# Altium project ((Inventory)).PrjPcb
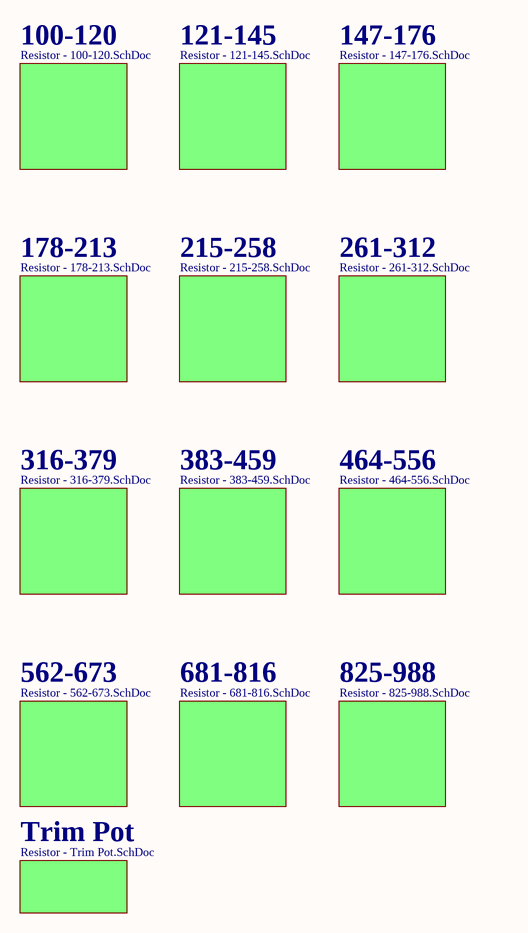
[diagram p0: Resistor.SchDoc]
7 sheets, 6 parts. Net scope: strictly hierarchical (ports join the sheet entries above them; power ports are local).
Sheets:
  Resistor.SchDoc
  Diode.SchDoc
  Ferrite.SchDoc
  Inductor.SchDoc
  Module.SchDoc
    LCD = Module - LCD.SchDoc
  Switch.SchDoc

## Sheet Resistor.SchDoc
size A; SheetNumber: 1; SheetTotal: 14

### Sub-sheets
100-120 = Resistor - 100-120.SchDoc (file not in this document): no entries
121-145 = Resistor - 121-145.SchDoc (file not in this document): no entries
147-176 = Resistor - 147-176.SchDoc (file not in this document): no entries
178-213 = Resistor - 178-213.SchDoc (file not in this document): no entries
215-258 = Resistor - 215-258.SchDoc (file not in this document): no entries
261-312 = Resistor - 261-312.SchDoc (file not in this document): no entries
316-379 = Resistor - 316-379.SchDoc (file not in this document): no entries
383-459 = Resistor - 383-459.SchDoc (file not in this document): no entries
464-556 = Resistor - 464-556.SchDoc (file not in this document): no entries
562-673 = Resistor - 562-673.SchDoc (file not in this document): no entries
681-816 = Resistor - 681-816.SchDoc (file not in this document): no entries
825-988 = Resistor - 825-988.SchDoc (file not in this document): no entries
Trim Pot = Resistor - Trim Pot.SchDoc (file not in this document): no entries

## Sheet Diode.SchDoc
size A3; SheetNumber: 22; SheetTotal: 41
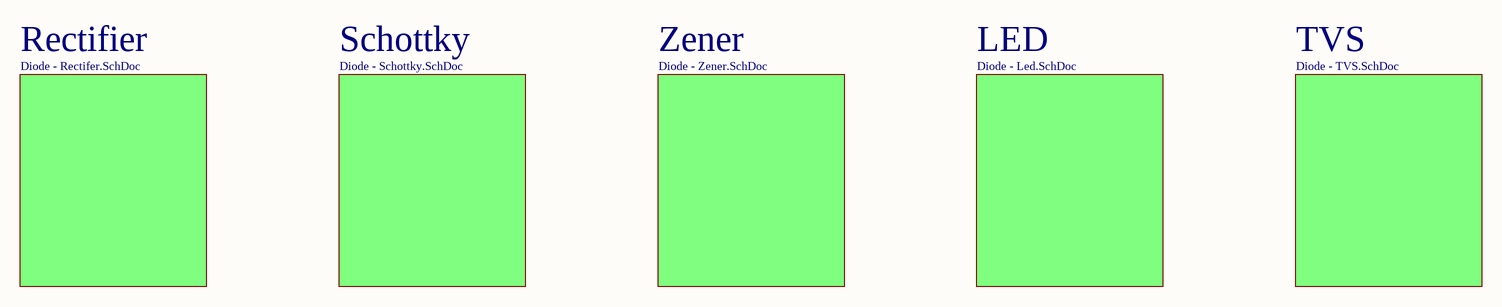
[diagram p1: Diode.SchDoc]

### Sub-sheets
LED = Diode - Led.SchDoc (file not in this document): no entries
Rectifier = Diode - Rectifer.SchDoc (file not in this document): no entries
Schottky = Diode - Schottky.SchDoc (file not in this document): no entries
TVS = Diode - TVS.SchDoc (file not in this document): no entries
Zener = Diode - Zener.SchDoc (file not in this document): no entries

## Sheet Ferrite.SchDoc
size A3; SheetNumber: 22; SheetTotal: 25
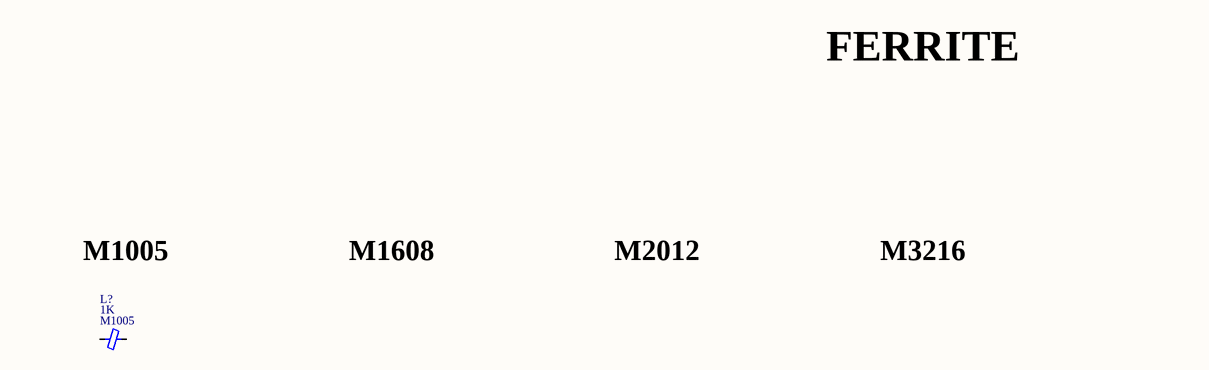
[diagram p2: Ferrite.SchDoc]

### Parts
(Parts that share a designator on the sheet are numbered #1, #2 ... from top to bottom, then left to right.)
L?#1  value 1K  Package: M1005  [Ferrite_Bead_Smd_M1005_I0402]  (hidden comment: Ferrite Bead)

### Nets

Not connected (* = marked no-connect by the designer): L?#1 1 2

### Notes on the sheet
- FERRITE
- (near L?#1) M1005
- M1608
- M2012
- M3216

### Library data of the parts
L?#1 = Ferrite Bead: Manufacturer Part Number: WLBD1005K2U102TP; Manufacturer: Walsin; Component Category: Inductor; ComponentLink1Description: Datasheet; ComponentLink1URL: E:\Altium\Datasheets\Inductor\Walsin, WLBD1005-WLBD4532 Chip Bead Series.pdf; ComponentLink2Description: Supplier Link; ComponentLink2URL: https://www.digikey.com/en/products/detail/walsin-technology-corporation/WLBD1005K2U102TP/14563847; Supplier: Digikey; Supplier Part Number: 1292-WLBD1005K2U102TPCT-ND; Operating Temperature, Min: -55℃; Operating Temperature, Max: +125℃; Quantity, Min: 1; Quantity, Max: 50000; Price, Min: 0.1; Price, Max: 0.0021; Supplier Currency: $; Supplier Link: https://www.digikey.com/en/products/detail/walsin-technology-corporation/WLBD1005K2U102TP/14563847; Component Type: Ferrite Bead

## Sheet Inductor.SchDoc
size A3; SheetNumber: 34; SheetTotal: 41
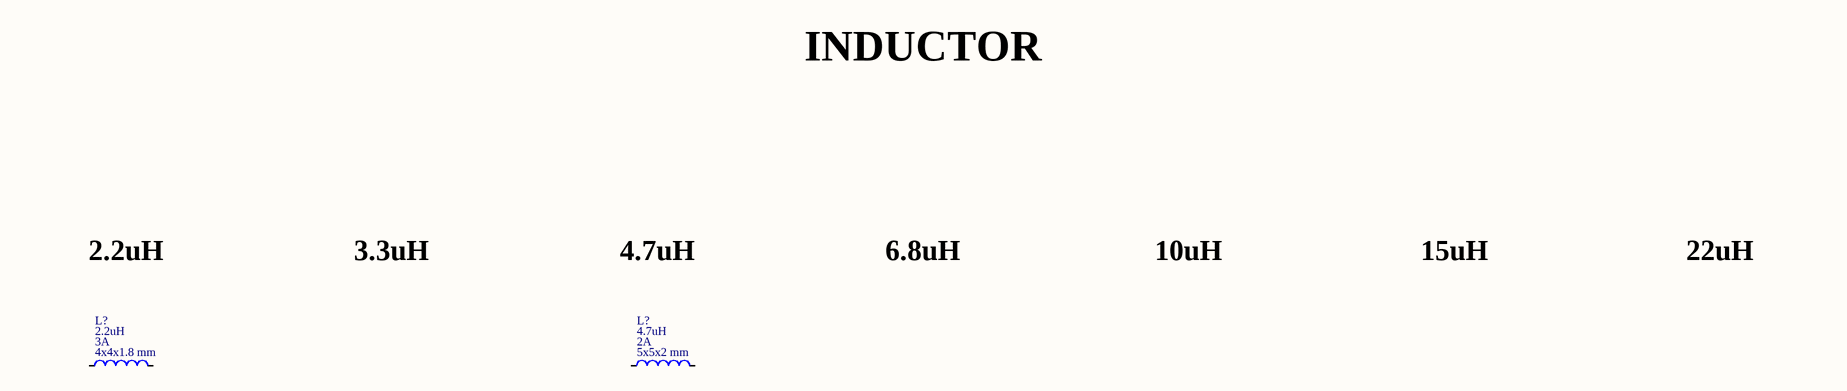
[diagram p3: Inductor.SchDoc]

### Parts
(Parts that share a designator on the sheet are numbered #1, #2 ... from top to bottom, then left to right.)
L?#2  value 2.2uH  Saturation Current: 3A  Package: 4x4x1.8 mm  [Taiyo Yuden - Power Inductor, 4040TK]  (hidden comment: Inductor)
L?#3  value 4.7uH  Saturation Current: 2A  Package: 5x5x2 mm  [Taiyo Yuden - Power Inductor, 5050WK]  (hidden comment: Inductor)

### Nets

Not connected (* = marked no-connect by the designer): L?#2 1 2; L?#3 1 2

### Notes on the sheet
- INDUCTOR
- 2.2uH
- 3.3uH
- 4.7uH
- 6.8uH
- 10uH
- 15uH
- 22uH

### Library data of the parts
L?#2 = Inductor: Inductor, Power, 2.2uH, 3A, 4x4x1.8mm; Manufacturer Part Number: NRS4018T2R2MDGJ; Manufacturer: Taiyo Yuden; ComponentLink1Description: Datasheet; ComponentLink1URL: E:\Altium\Datasheets\Inductor\Taiyo Yuden - NRx Series.pdf; ComponentLink2Description: Supplier Link; ComponentLink2URL: https://www.digikey.com/en/products/detail/taiyo-yuden/NRS4018T2R2MDGJ/2648968; Supplier: Digikey; Supplier Part Number: 587-2890-1-ND; Operating Temperature, Min: -25℃; Operating Temperature, Max: +120℃; Quantity, Min: 1; Quantity, Max: 87500; Price, Min: 0.27; Price, Max: 0.08633; Supplier Currency: $; Supplier Link: https://www.digikey.com/en/products/detail/taiyo-yuden/NRS4018T2R2MDGJ/2648968; Component Type: Power Inductor; Component Category: Inductor
L?#3 = Inductor: Inductor, Power, 4.7uH, 2A, 5x5x2mm; Manufacturer Part Number: NRS5020T4R7MMGJ; Manufacturer: Taiyo Yuden; ComponentLink1Description: Datasheet; ComponentLink1URL: E:\Altium\Datasheets\Inductor\Taiyo Yuden - NRx Series.pdf; ComponentLink2Description: Supplier Link; ComponentLink2URL: https://www.digikey.com/en/products/detail/taiyo-yuden/NRS5020T4R7MMGJ/2230192; Supplier: Digikey; Supplier Part Number: 587-2890-1-ND; Operating Temperature, Min: -25℃; Operating Temperature, Max: +125℃; Quantity, Min: 1; Quantity, Max: 20000; Price, Min: 0.31; Price, Max: 0.1079; Supplier Currency: $; Supplier Link: https://www.digikey.com/en/products/detail/taiyo-yuden/NRS5020T4R7MMGJ/2230192; Component Type: Power Inductor; Component Category: Inductor

## Sheet Module.SchDoc
size A3; SheetNumber: 29; SheetTotal: 30
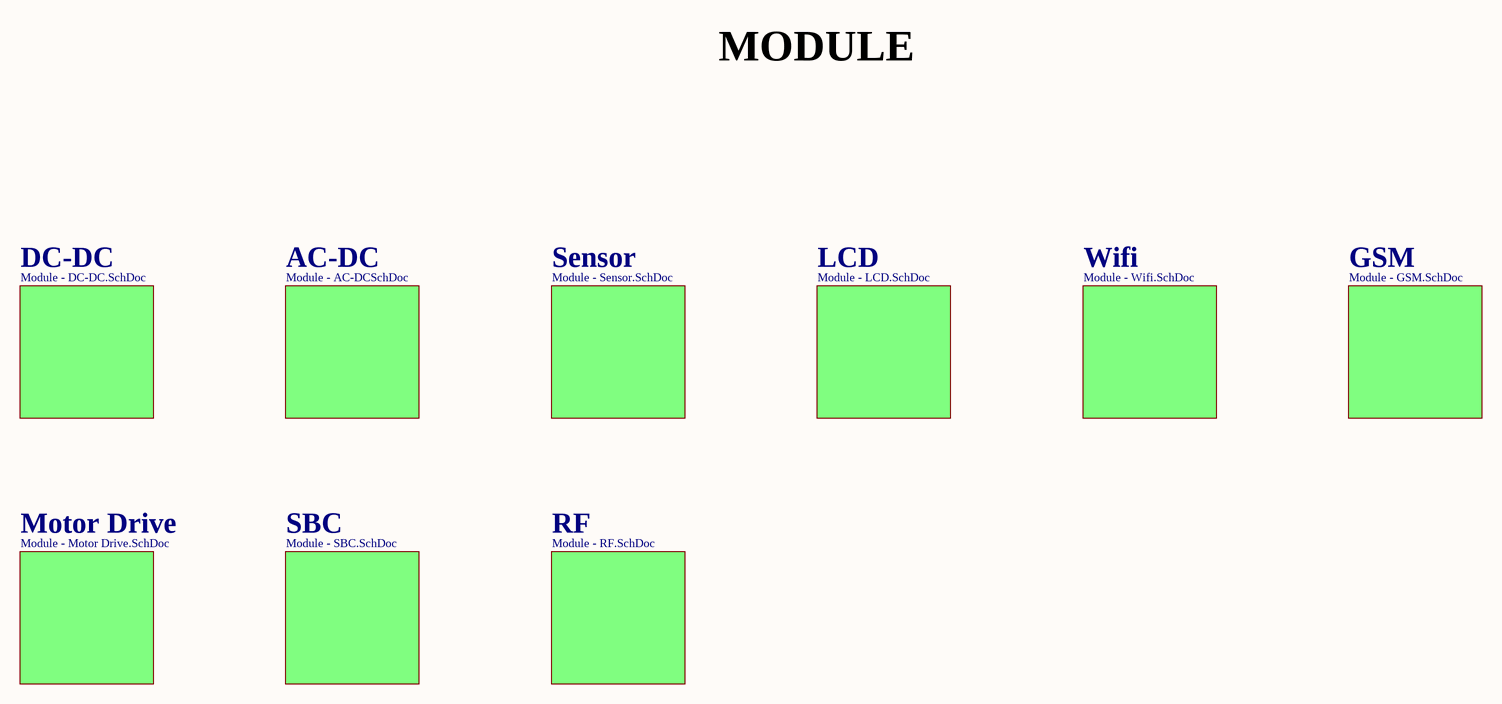
[diagram p4: Module.SchDoc]

### Sub-sheets
AC-DC = Module - AC-DCSchDoc (file not in this document): no entries
DC-DC = Module - DC-DC.SchDoc (file not in this document): no entries
GSM = Module - GSM.SchDoc (file not in this document): no entries
LCD = Module - LCD.SchDoc: no entries
Motor Drive = Module - Motor Drive.SchDoc (file not in this document): no entries
RF = Module - RF.SchDoc (file not in this document): no entries
SBC = Module - SBC.SchDoc (file not in this document): no entries
Sensor = Module - Sensor.SchDoc (file not in this document): no entries
Wifi = Module - Wifi.SchDoc (file not in this document): no entries

### Notes on the sheet
- MODULE

## Sheet Module - LCD.SchDoc
size A4; SheetNumber: 37; SheetTotal: 41
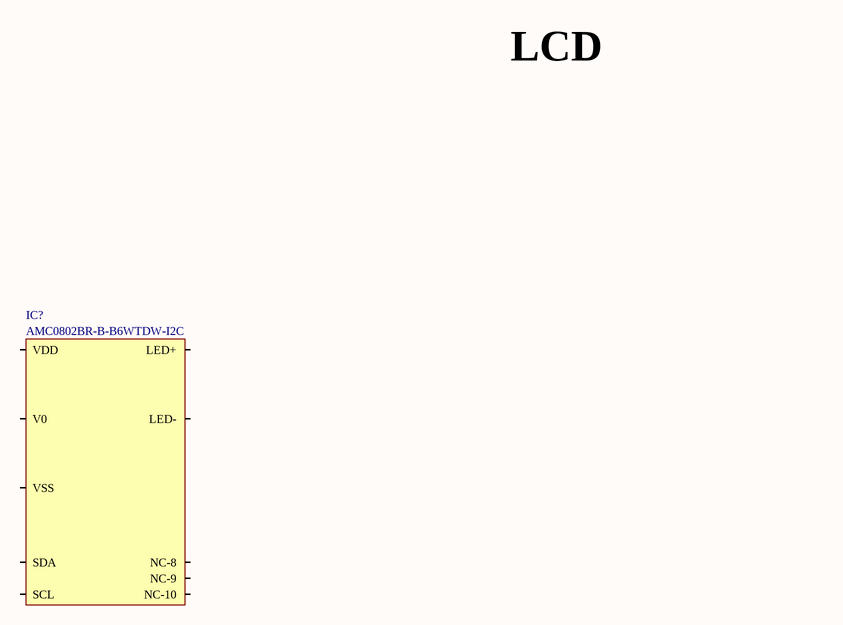
[diagram p5: Module - LCD.SchDoc]

### Parts
IC?  Manufacturer Part Number: AMC0802BR-B-B6WTDW-I2C  [Orient, AMC0802BR-B-B6WTDW-I2C]  (hidden comment: Orient, AMC0802BR-B-B6WTDW-I2C)

### Nets

Not connected (* = marked no-connect by the designer): IC? LED+ LED- NC-8 NC-9 NC-10 SCL SDA V0 VDD VSS

### Notes on the sheet
- LCD

### Library data of the parts
IC? = Orient, AMC0802BR-B-B6WTDW-I2C: Module, Display, Lcd, 2 Lines, I2C; Manufacturer: Orient Display; ComponentLink1Description: Datasheet; ComponentLink1URL: E:\Altium\Datasheets\Module - LCD\Orient, AMC0802BR-B-B6WTDW-I2C.pdf; ComponentLink2Description: Supplier Link; ComponentLink2URL: https://www.digikey.com/en/products/detail/orient-display/AMC0802BR-B-B6WTDW-I2C/12089222; Supplier: Digikey; Supplier Part Number: 3444-AMC0802BR-B-B6WTDW-I2C-ND; Operating Temperature, Min: -20℃; Operating Temperature, Max: +70℃; Quantity, Min: 1; Quantity, Max: 2000; Price, Min: 8.69; Supplier Currency: $; Price, Max: 4.21208; Supplier Link: https://www.digikey.com/en/products/detail/orient-display/AMC0802BR-B-B6WTDW-I2C/12089222; Component Type: LCD; Component Category: Module; Package: Custom

## Sheet Switch.SchDoc
size A4; SheetNumber: 36; SheetTotal: 37
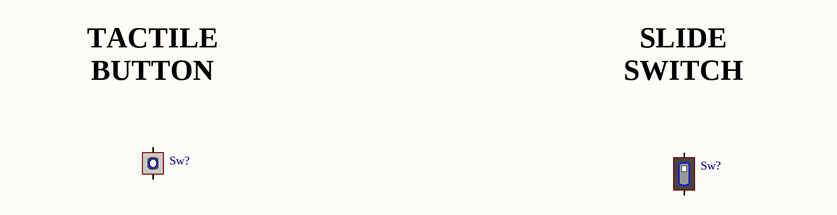
[diagram p6: Switch.SchDoc]

### Parts
(Parts that share a designator on the sheet are numbered #1, #2 ... from top to bottom, then left to right.)
Sw?#1  Tactile, SPST  [Tactile, SPST - Panasonic, EVQQ2]  (value not drawn)
Sw?#2  Slide, SPST  [Slide, SPST - C&K, SDA01HxS]  (value not drawn)

### Nets

Not connected (* = marked no-connect by the designer): Sw?#1 A B; Sw?#2 A B

### Notes on the sheet
- (near Sw?#1) TACTILE
  BUTTON
- SLIDE
  SWITCH

### Library data of the parts
Sw?#1 = Tactile, SPST: Switch, Tactile, SPST, SMD; Manufacturer: Panasonic; Manufacturer Part Number: EVQ-Q2K03W; ComponentLink1Description: Datasheet; ComponentLink1URL: E:\Altium\Datasheets\Switch\Tactile, SPST - Panasonic, EVQP0, EVQQ2, EVQ6Q2, EVQ7Q2, EVPBT Series.pdf; ComponentLink2Description: Supplier Link; ComponentLink2URL: https://www.digikey.com/en/products/detail/panasonic-electronic-components/EVQ-Q2K03W/762893; Supplier: Digikey; Supplier Part Number: P12943SCT-ND; Operating Temperature, Min: -40℃; Operating Temperature, Max: +85℃; Quantity, Min: 1; Quantity, Max: 10000; Price, Min: 0.32; Supplier Currency: $; Price, Max: 0.16174; Supplier Link: https://www.digikey.com/en/products/detail/panasonic-electronic-components/EVQ-Q2K03W/762893; Component Type: Tactile; Component Category: Switch; Package: SMD
Sw?#2 = Slide, SPST: Switch, Slide, SPST, SMD; Manufacturer: C&K; Manufacturer Part Number: SDA01H1SBD; ComponentLink1Description: Datasheet; ComponentLink1URL: E:\Altium\Datasheets\Switch\Slide, SPST - C&K, SDA Series.pdf; ComponentLink2Description: Supplier Link; ComponentLink2URL: https://www.digikey.com/en/products/detail/c-k/SDA01H1SBD/2263273; Supplier: Digikey; Supplier Part Number: CKN10358-ND; Operating Temperature, Min: -40℃; Operating Temperature, Max: +85℃; Quantity, Min: 1; Quantity, Max: 5000; Price, Min: 1.34; Supplier Currency: $; Price, Max: 0.69803; Supplier Link: https://www.digikey.com/en/products/detail/c-k/SDA01H1SBD/2263273; Component Type: Slide; Component Category: Switch; Package: SMD